# Altium schematic sheet Power.SchDoc
size A4; SheetNumber: 4; SheetTotal: 4
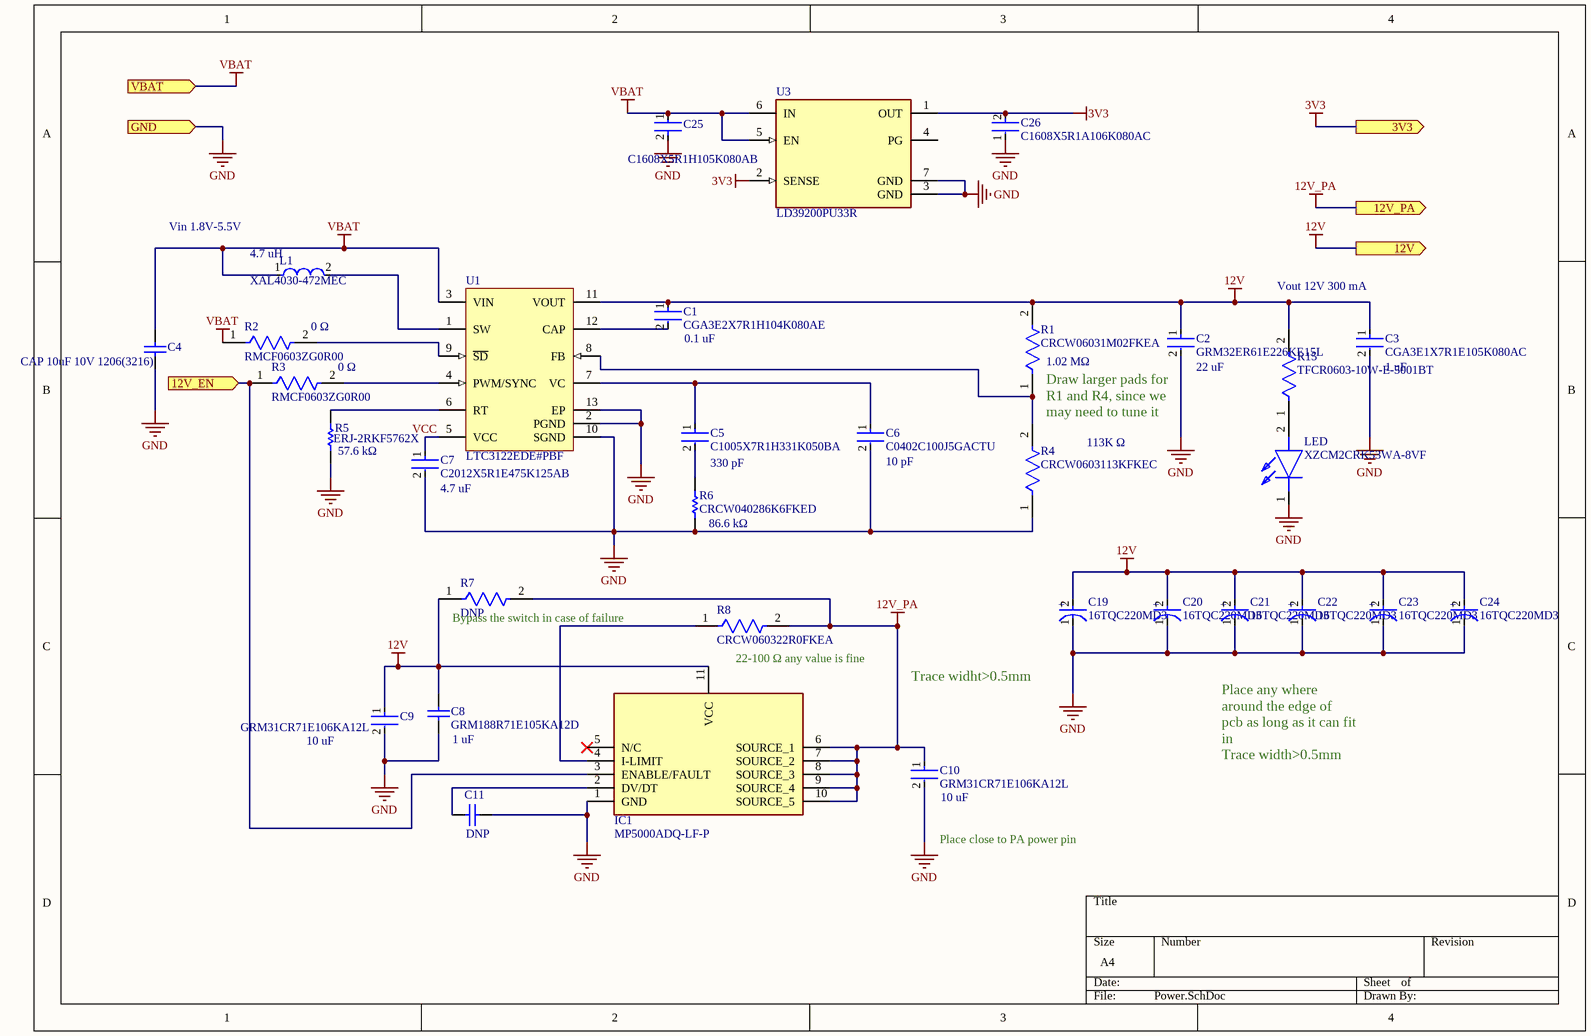
[diagram p0: Power.SchDoc]

## Parts
C1  CGA3E2X7R1H104K080AE  [FP-CGA3E-0_3-0_1-IPC_A]
C2  GRM32ER61E226KE15L  [FP-GRM32-MFG]
C3  CGA3E1X7R1E105K080AC  [FP-CGA3E-0_3-0_1-IPC_A]
C4  CAP 10uF 10V 1206(3216)  [CAPC1206(3216)190_L]
C5  C1005X7R1H331K050BA  [FP-C1005-050-0_05-IPC_B]
C6  C0402C100J5GACTU  [FP-C0402-BB-MFG]
C7  C2012X5R1E475K125AB  [FP-C2012-125-0_2-MFG]
C8  GRM188R71E105KA12D  [CAPC1608X90X35ML10T15]
C9  GRM31CR71E106KA12L  [FP-GRM31C-0_2-e0_3_0_8-MFG]
C10  GRM31CR71E106KA12L  [FP-GRM31C-0_2-e0_3_0_8-MFG]
C11  DNP  [CAPC1608X90X35NL10T15]
C19  16TQC220MD3  [FP-POSCAP-D3L-MFG]
C20  16TQC220MD3  [FP-POSCAP-D3L-MFG]
C21  16TQC220MD3  [FP-POSCAP-D3L-MFG]
C22  16TQC220MD3  [FP-POSCAP-D3L-MFG]
C23  16TQC220MD3  [FP-POSCAP-D3L-MFG]
C24  16TQC220MD3  [FP-POSCAP-D3L-MFG]
C25  C1608X5R1H105K080AB  [FP-C1608-080-0_1-IPC_B]
C26  C1608X5R1A106K080AC  [FP-C1608-080-0_1-MFG]
IC1  MP5000ADQ-LF-P  [SON50P300X300X100-11N-D]
L1  XAL4030-472MEC  [FP-XAL4030-472MEC-MFG]
LED  XZCM2CRK53WA-8VF  [XZCFBB53W8VF]
R1  CRCW06031M02FKEA  [FP-CRCW0603-e3-IPC_A]
R2  RMCF0603ZG0R00  [FP-RMCF0603-IPC_B]
R3  RMCF0603ZG0R00  [FP-RMCF0603-IPC_B]
R4  CRCW0603113KFKEC  [FP-CRCW0603-e3-MFG]
R5  ERJ-2RKF5762X  [RESC1005X40X25NL05T05]
R6  CRCW040286K6FKED  [RESC1005X40X25NL05T05]
R7  DNP  [FP-RMCF0603-IPC_B]
R8  CRCW060322R0FKEA  [FP-CRCW0603-e3-IPC_B]
R15  TFCR0603-10W-E-5001BT  [FP-TFCR0603-IPC_C]
U1  LTC3122EDE#PBF  [LT-DE-UE-12_V]
U3  LD39200PU33R  [FP-DFN6-7946637-MFG]

## Ports
3V3 (out), 12V (out), 12V_EN (in), 12V_PA (out), GND (in), VBAT (in)

## Nets
3V3: C26.2 U3.1(OUT) U3.2(SENSE) ; port 3V3
12V: C1.1 C2.1 C3.1 C8.2 C9.1 C19.2(A) C20.2(A) C21.2(A) C22.2(A) C23.2(A) C24.2(A) IC1.11(VCC) R1.2 R7.1 R15.2 U1.11(VOUT) ; port 12V
12V_PA: C10.1 IC1.6(SOURCE_1) IC1.7(SOURCE_2) IC1.8(SOURCE_3) IC1.9(SOURCE_4) IC1.10(SOURCE_5) R7.2 R8.2 ; port 12V_PA
GND: C2.2 C3.2 C4.1 C6.2 C7.2 C8.1 C9.2 C10.2 C11.1 C19.1(C) C20.1(C) C21.1(C) C22.1(C) C23.1(C) C24.1(C) C25.2 C26.1 IC1.1(GND) LED.1(K) R4.1 R5.1 R6.1 U1.2(PGND) U1.10(SGND) U1.13(EP) U3.3(GND) U3.7(GND) ; port GND
VBAT: C4.2 C25.1 L1.1 R2.1 U1.3(VIN) U3.5(EN) U3.6(IN) ; port VBAT
12V_EN: IC1.3(ENABLE/FAULT) R3.1 ; port 12V_EN
VCC: C7.1 U1.5(VCC)
NetC1_2: C1.2 U1.12(CAP)
NetC5_1: C5.1 C6.1 U1.7(VC)
NetC5_2: C5.2 R6.2
NetC11_2: C11.2 IC1.2(DV/DT)
NetIC1_4: IC1.4(I-LIMIT) R8.1
NetL1_2: L1.2 U1.1(SW)
NetLED_2: LED.2(A) R15.1
NetR1_1: R1.1 R4.2 U1.8(FB)
NetR2_2: R2.2 U1.9(~{SD})
NetR3_2: R3.2 U1.4(PWM/SYNC)
NetR5_2: R5.2 U1.6(RT)

Not connected (* = marked no-connect by the designer): IC1 5(N/C)*; U3 4(PG)

## Notes on the sheet
- Vin 1.8V-5.5V
- (near L1) 4.7 uH
- Vout 12V 300 mA
- (near R2) 0 Ω
- (near R3) 0 Ω
- (near C1) 0.1 uF
- (near R1) 1.02 MΩ
- (near C2) 22 uF
- (near C3) 1 uF
- Draw larger pads for R1 and R4, since we may need to tune it
- 113K Ω
- (near R5) 57.6 kΩ
- (near C7) 4.7 uF
- 330 pF
- (near C6) 10 pF
- (near R6) 86.6 kΩ
- (near R7) Bypass the switch in case of failure
- 22-100 Ω any value is fine
- Trace widht>0.5mm
- (near C9) 10 uF
- (near C8) 1 uF
- Place any where around the edge of pcb as long as it can fit in
  Trace width>0.5mm
- Place close to PA power pin
- (near C10) 10 uF
- (in symbol CMP-05428-000297-1) +

## Library data of the parts
C1 = CMP-08246-002410-1: Cap Ceramic 100nF 50V X7R 10% Pad SMD 0603 +125°C Automotive T/R; Thickness: 0.035inch; Dielectric: X7R; Height: 0.8mm; Min Operating Temperature: -55°C; Package Quantity: 4000; Voltage Rating: 50V; Voltage Rating (DC): 50V; Lead Free: Lead Free; Case Code (Metric): 1608; Ratings: AEC-Q200; Capacitance: 100nF; Length: 0.063inch; Width: 0.8mm; Weight: 7.1E-05oz; Case/Package: 0603; Case Code (Imperial): 0603; Termination: SMD/SMT; Mount: Surface Mount; Packaging: Tape and Reel; Max Operating Temperature: 125°C; Tolerance: 10%; Features: Soft Termination
C2 = CMP-2000-05458-2: CAP CER 22UF 25V X5R 1210; Manufacturer: Murata Electronics North America; Possible Substitute: GRM32ER61E226KE15K; Other Names: 490-3889-2; Material: Ceramic; Tolerance: 10%; Digikey Description: CAP CER 22UF 25V X5R 1210; Mouser Description: Multilayer Ceramic Capacitors MLCC - SMD/SMT 1210 22uF 25volts X5R 10%; Device Class L2: Capacitors; Height: 2.7mm; Temperature Characteristic: X5R; Category: Cap; RoHS: TRUE; Operating Temperature: -55°C ~ 85°C; Temperature: -55°C to +85°C; Lead Free: Yes; Package: GRM32; Temperature Range High: +85°C; Package / Case: 1210 (3225 Metric); Standard Package: 1,000; Packaging: Cut Tape (CT); Capacitance: 22uF; Thickness (Max): 0.106" (2.70mm); Value: 22uF; Automotive: No; Device Class L1: Passive Components; Voltage - Rated: 25V; Temperature Range Low: -55°C; Size / Dimension: 0.126" L x 0.098" W (3.20mm x 2.50mm); ComponentLink2Description: Datasheet; Device Class L3: Ceramic Capacitors; Temperature Coefficient: X5R; ComponentLink2URL: https://search.murata.co.jp/Ceramy/image/img/A01X/G101/ENG/GRM32ER61E226KE15-01A.pdf; Voltage Rating: 25V; Manufacturer Part Number: GRM32ER61E226KE15L; Octopart: https://octopart.com/grm32er61e226ke15l-murata-197441; Applications: General Purpose; Mounting Type: Surface Mount, MLCC
C3 = CMP-08246-001507-1: Cap Ceramic 1uF 25V X7R 10% Pad SMD 0603 +125°C Automotive T/R; Dielectric: X7R; Capacitance: 1uF; Voltage Rating: 25V; Thickness: 0.035inch; Width: 0.031inch; Ratings: AEC-Q200; Case Code (Metric): 1608; REACH SVHC: No SVHC; Voltage: 25V; Composition: Ceramic; Min Operating Temperature: -55°C; Termination: SMD/SMT; Depth: 0.8mm; Max Operating Temperature: 125°C; Mount: Surface Mount; Weight: 7.1E-05oz; Package Quantity: 4000; Tolerance: 10%; Packaging: Tape and Reel; Lead Free: Lead Free; Case/Package: 0603; Length: 1.6mm; Height: 0.8mm; Case Code (Imperial): 0603; Voltage Rating (DC): 25V
C4 = CMP-1037-04967-1: CAP 10uF 10V ±10% 1206 (3216 Metric) Thickness 1.9mm SMD; Tolerance: Â±10%; Case-Metric: 3216; Case-EIA: 1206; Rated Voltage: 10 V; Max Thickness: 1.9 mm; Technology: SMT; Value: 10uF
C5 = CMP-08246-002681-1: Multilayer Ceramic Capacitors 330pF ±10% 50V X7R SMD 0402; Height: 0.5mm; Min Operating Temperature: -55°C; Construction: Flat; Voltage Rating (DC): 50V; Depth: 0.5mm; Number of Pins: 2; Capacitance: 330pF; Case/Package: 0402; REACH SVHC: No SVHC; Lead Free: Lead Free; Thickness: 0.022inch; Package Quantity: 1; Case Code (Imperial): 0402; Max Operating Temperature: 125°C; RoHS Compliant: Yes; Voltage Rating: 50V; Length: 1mm; Weight: 2.3E-05oz; Width: 0.02inch; Case Code (Metric): 1005; Dielectric Material: Ceramic; Tolerance: 10%; Mount: Surface Mount; Dielectric: X7R; Series: C; Resistor Type: Ceramic; Termination: SMD/SMT; Packaging: Tape and Reel
C6 = CMP-2008-03404-2: Multilayer Ceramic Capacitor, C Series, 10 Pf, - 5%, C0G / Np0, 50 V, 0402 [1005 Metric] Rohs Compliant: Yes; Manufacturer: Kemet; Temperature Coefficient: 15%; Voltage Rating: 50 V; Capacitance: 10 pF; Value: 10 pF; Tolerance: 0.05; Automotive: No; Temperature Range High: +125°C; ComponentLink2Description: Datasheet; Manufacturer Part Number: C0402C100J5GACTU; Material: Ceramic; Lead Free: Yes; ComponentLink2URL: https://content.kemet.com/datasheets/KEM_C1002_X7R_SMD.pdf; Device Class L3: Ceramic Capacitors; RoHS: TRUE; Package: C0402-BB; Temperature: -55°C to +125°C; Temperature Range Low: -55°C; Height: 0.55mm; Mouser Description: Multilayer Ceramic Capacitor, C Series, 10 Pf, - 5%, C0G / Np0, 50 V, 0402 [1005 Metric] Rohs Compliant: Yes; Octopart: https://octopart.com/c0402c100j5gactu-kemet-108448; Digikey Description: Multilayer Ceramic Capacitor, C Series, 10 Pf, - 5%, C0G / Np0, 50 V, 0402 [1005 Metric] Rohs Compliant: Yes; Temperature Characteristic: C0G; Category: Cap; Ipc Land Pattern Name: CAPC10050X50; Device Class L1: Passive Components; Device Class L2: Capacitors
C7 = CMP-08246-004908-1: Multilayer Ceramic Capacitors 4.7μF ±10% 25V X5R SMD 0805; Capacitance: 4.7uF; Lead Free: Lead Free; Thickness: 0.057inch; Packaging: Tape and Reel; Min Operating Temperature: -55°C; RoHS Compliant: Yes; Dielectric: X5R; Weight: 0.000194oz; REACH SVHC: No SVHC; Voltage Rating (DC): 25V; Mount: Surface Mount; Resistor Type: Ceramic; Termination: SMD/SMT; Number of Pins: 2; Case Code (Imperial): 0805; Dielectric Material: Ceramic; Voltage: 25V; Voltage Rating: 25V; Case Code (Metric): 2012; Case/Package: 0805; Max Operating Temperature: 85°C; Height: 1.25mm; Tolerance: 10%; Depth: 1.25mm; Package Quantity: 1; Length: 2mm; Radiation Hardening: No; Width: 1.25mm
C8 = CMP-2006-02460-1: Manufacturer: Murata; Part Number: GRM188R71E105KA12D
C9 C10 = CMP-06035-003589-1: Chip Multilayer Ceramic Capacitors for General Purpose, 1206, 10uF, X7R, 15%, 10%, 25V; Case Code (Imperial): 1206; Voltage Rating (DC): 25V; Voltage Rating: 25V; Length: 3.2mm; Lead Free: Lead Free; Thickness: 0.071inch; Package Quantity: 1; Width: 1.6mm; Max Operating Temperature: 125°C; Number of Pins: 2; Height: 1.6mm; Case Code (Metric): 3216; REACH SVHC: No SVHC; Radiation Hardening: No; Case/Package: 1206; Material: Ceramic; Tolerance: 10%; Voltage: 25V; Mount: Surface Mount; Packaging: Tape and Reel; Dielectric: X7R; Termination: SMD/SMT; Min Operating Temperature: -55°C; Capacitance: 10uF; Depth: 1.6mm
C11 = CMP-2006-02680-1: GRM1885C1H560JA01D; Manufacturer: Murata; Part Number: GRM1885C1H560JA01D
C19-C24 = CMP-05428-000297-1: Molded Tantalum Polymer Capacitor 220uF 20% 16V life 2000Hours SMD 2917; RoHS Compliant: Yes
C25 = CMP-2000-06025-2: Multilayer Ceramic Capacitors 1μF ±10% 50V X5R SMD 0603; Capacitance: 1uF; Lead Free: Lead Free; Height: 0.8mm; Mount: Surface Mount; Radiation Hardening: No; Thickness: 0.035inch; Length: 1.6mm; Max Operating Temperature: 85°C; REACH SVHC: No SVHC; Min Operating Temperature: -55°C; Construction: Flat; RoHS Compliant: Yes; Voltage Rating: 50V; Dielectric: X5R; Packaging: Tape and Reel; Termination: SMD/SMT; Voltage Rating (DC): 50V; Case Code (Imperial): 0603; Voltage: 50V; Width: 0.031inch; Weight: 7.1E-05oz; Depth: 0.8mm; Case Code (Metric): 1608; Series: C; Case/Package: 0603; Tolerance: 10%; Resistor Type: Ceramic; Number of Pins: 2; Dielectric Material: Ceramic; Package Quantity: 1
C26 = CMP-2000-04979-3: Multilayer Ceramic Capacitors 10μF ±10% 10V X5R SMD 0603; Capacitance: 10uF; Dielectric Material: Ceramic; Construction: Flat; Height: 0.8mm; Thickness: 0.035inch; Case Code (Metric): 1608; Radiation Hardening: No; Number of Pins: 2; Voltage Rating (DC): 10V; Depth: 0.8mm; Voltage: 10V; RoHS Compliant: Yes; Voltage Rating: 10V; Package Quantity: 1; Resistor Type: Ceramic; Termination: SMD/SMT; Lead Free: Lead Free; REACH SVHC: No SVHC; Tolerance: 10%; Mount: Surface Mount; Series: C; Packaging: Tape and Reel; Width: 0.8mm; Dielectric: X5R; Weight: 7.1E-05oz; Length: 1.6mm; Max Operating Temperature: 85°C; Case Code (Imperial): 0603; Case/Package: 0603; Min Operating Temperature: -55°C
IC1 = MP5000ADQ-LF-P: Integrated Circuit; Manufacturer_Name: Monolithic Power Systems (MPS); Datasheet Link: https://www.monolithicpower.com/en/documentview/productdocument/index/version/2/document_type/Datasheet/lang/en/sku/MP5000A/; Height: 1mm; Manufacturer_Part_Number: MP5000ADQ-LF-P; Mouser Part Number: 946-MP5000ADQ-LF-P; Mouser Price/Stock: https://www.mouser.co.uk/ProductDetail/Monolithic-Power-Systems-MPS/MP5000ADQ-LF-P?qs=%252BZix9lVCYc%252BkK4nDbCRuaQ%3D%3D
L1 = CMP-11268-000082-1: Power Inductor (SMD), 4.7 µH, 5.1 A, Shielded, 4.5 A, XAL40xx Series, 4mm x 4mm x 3.1mm; Tolerance: 20%; DC Resistance (DCR): 44.1mR; Inductance: 4.7uH; Saturation Current: 4.5A; Max DC Current: 5.1A; Self Resonant Frequency: 36MHz; Test Frequency: 100kHz; Core Material: Composite; REACH SVHC: No SVHC; Height: 3.1mm; Package Quantity: 500; Width: 4.3mm; Mount: Surface Mount; RoHS Compliant: Yes; Case/Package: SMD/SMT; Length: 4.3mm; Packaging: Tape and Reel; Max Operating Temperature: 125°C; Min Operating Temperature: -40°C; Series: XAL4030; Termination: SMD/SMT; Inductance Tolerance: 20%; Shielding: Shielded; RMS Current (Irms): 5.1A; Lead Free: Contains Lead
LED = XZCM2CRK53WA-8VF: LED; Manufacturer_Name: SunLED; Datasheet Link: https://datasheet.datasheetarchive.com/originals/distributors/Datasheets_SAMA/e996e994ade8bc327c2da19cfbdeeadc.pdf; Height: 1.1mm; Manufacturer_Part_Number: XZCM2CRK53WA-8VF
R1 = CMP-2000-03018-2: RES Thick Film, 1.02MΩ, 1%, 0.1W, 100ppm/°C, 0603; Voltage Rating (DC): 75V; Power Rating: 100mW; Resistance: 1.02MR; Features: Automotive AEC-Q200; Depth: 0.85mm; Max Operating Temperature: 155°C; Tolerance: 1%; Package Quantity: 10; Length: 1.55mm; Mount: Surface Mount; Termination: SMD/SMT; Width: 0.033inch; Temperature Coefficient: 100ppm/°C; Min Operating Temperature: -55°C; Composition: Thick Film; Max Power Dissipation: 100mW; Case Code (Imperial): 0603; Case/Package: 0603; Voltage Rating: 75V; Contact Plating: Tin; Case Code (Metric): 1608; Weight: 7.1E-05oz; Lead Free: Lead Free; Height: 0.02inch; Military Standard: Not; Number of Terminations: 2; Radiation Hardening: No; Packaging: Tape and Reel
R2 R3 = CMP-26527-006412-1: 0Ω ±0 0.1W 0603 Thick Film Chip Resistor AEC-Q200 compliant; Max Power Dissipation: 100mW; Resistance: 0R; Width: 0.031inch; RoHS Compliant: Yes; Number of Terminations: 2; Case/Package: 0603; Contact Plating: Tin; Height: 0.022inch; Resistor Type: Thick Film; Mount: Surface Mount; Length: 0.061inch; Features: Automotive AEC-Q200; Series: RMCF; Max Operating Temperature: 155°C; Radiation Hardening: No; Min Operating Temperature: -55°C; Packaging: Tape and Reel
R4 = CMP-02407-003381-1: RES Thick Film, 113kΩ, 1%, 0.1W, 100ppm/°C, 0603; Power Rating: 100mW; Resistance: 113kR; Packaging: Tape and Reel; Width: 0.033inch; Lead Free: Lead Free; Case/Package: 0603; Height: 0.02inch; Length: 0.061inch; Max Power Dissipation: 100mW; Composition: Thick Film; Tolerance: 1%; Number of Terminations: 2; Max Operating Temperature: 155°C; Min Operating Temperature: -55°C; Temperature Coefficient: 100ppm/°C; Features: Automotive AEC-Q200; Package Quantity: 20000
R5 = CMP-2002-01001-1: Manufacturer: Panasonic; Part Number: ERJ-2RKF5762X
R6 = CMP-2002-00247-1: Manufacturer: Vishay Dale; Part Number: CRCW040286K6FKED
R7 = CMP-26527-006412-1: Max Power Dissipation: 100mW; Resistance: 0R; Width: 0.031inch; RoHS Compliant: Yes; Number of Terminations: 2; Case/Package: 0603; Contact Plating: Tin; Height: 0.022inch; Resistor Type: Thick Film; Mount: Surface Mount; Length: 0.061inch; Features: Automotive AEC-Q200; Series: RMCF; Max Operating Temperature: 155°C; Radiation Hardening: No; Min Operating Temperature: -55°C; Packaging: Tape and Reel
R8 = CMP-2000-03097-2: RES Thick Film, 22Ω, 1%, 0.1W, 100ppm/°C, 0603; Voltage Rating: 75V; Power Rating: 100mW; Resistance: 22R; Lead Free: Lead Free; Height: 0.45mm; Package Quantity: 5000; Weight: 7.1E-05oz; Width: 0.85mm; Length: 1.55mm; Mount: Surface Mount; Packaging: Tape and Reel; Termination: SMD/SMT; Temperature Coefficient: 100ppm/°C; Case/Package: 0603; Case Code (Metric): 1608; Radiation Hardening: No; Max Operating Temperature: 155°C; Military Standard: Not; Min Operating Temperature: -55°C; Case Code (Imperial): 0603; Contact Plating: Tin; Voltage Rating (DC): 75V; Tolerance: 1%; Depth: 0.85mm; Composition: Thick Film
R15 = CMP-250906-228113-1: RES Thin Film,  4kΩ, 0.1%, 0.1W, 25ppm/°C, 0603
U1 = CMP-0492-00369-1: 2.5 A Synchronous Step-Up DC/DC Converter with Output Disconnect, 12-pin SON (DE-UE-12), -40 to 125 degC, Pb-Free; Manufacturer: Linear Technology; Number of Outputs: 1; ComponentLink2URL: http://cds.linear.com/docs/en/datasheet/3122fa.pdf; ComponentLink1URL: http://www.linear.com/; Code_JEDEC: MO-229; ComponentLink2Description: Datasheet; ComponentLink1Description: Manufacturer URL; PackageReference: DE-UE-12; PackageVersion: Rev. D, 06/2010; ComponentLink3Description: Package Specification; PackageDescription: 12-Pin Plastic DFN, Body 4 x 3 mm, Pitch 0.5 mm; PartNumber: LTC3122EDE#PBF; ComponentLink3URL: http://cds.linear.com/docs/en/packaging/DFN_12_05-08-1695.pdf; Mounting Technology: Surface Mount; RoHS: TRUE; DatasheetVersion: Rev. A
U3 = CMP-12153-000011-1: IC REG LINEAR 3.3V 2A 6DFN; Number of Outputs: 1; Max Input Voltage: 6V; Output Type: Fixed; Min Input Voltage: 1.25V; Dropout Voltage: 130mV; Operating Supply Current: 1mA; Number of Regulators: 1; Case/Package: DFN; Packaging: Tape and Reel; Output Current: 2A; Min Operating Temperature: -40°C; Mount: Surface Mount; Output Voltage: 3.3V; Max Operating Temperature: 125°C; Lead Free: Lead Free; Package Quantity: 3000